# EAGLE board Arch Max (EAGLE 6.4)
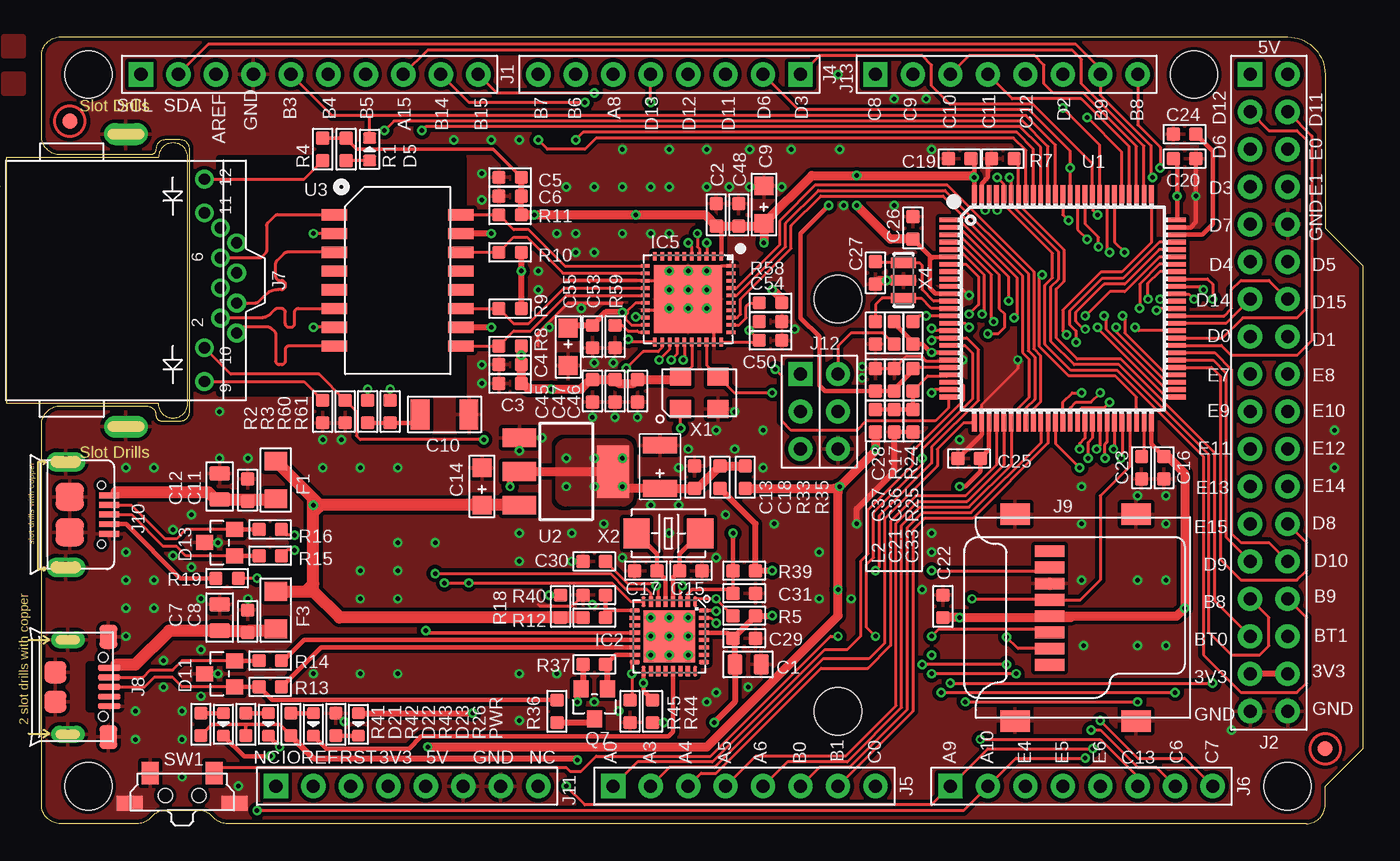
[diagram p2: board, top side]
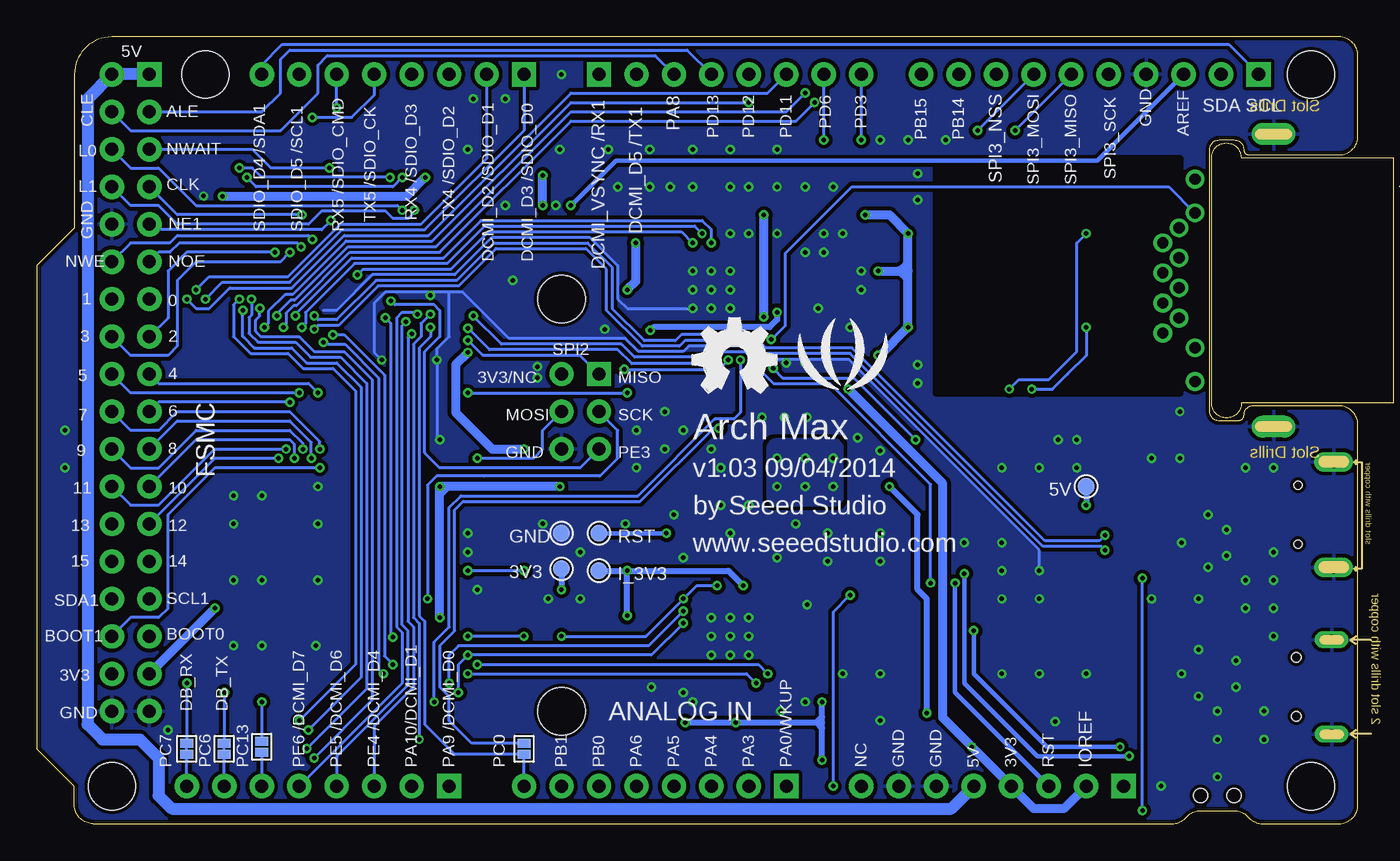
[diagram p3: board, bottom side, seen from below]

Size 89.53 x 53.34 mm. Coordinates in mm from the lower left corner, seen from the top.
Outline: 85.72,0 12.59,0 arc-45 11.69,0.37 11.55,0.52 arc45 10.65,0.89 8.4,0.89 arc45 7.5,0.52 7.36,0.37 arc-45 6.46,0 1.27,0 arc-90 0,1.27 0,27.05 arc-90 1.27,28.32 7.11,28.32 arc-90 7.75,27.69 arc90 8.13,27.3 9.4,27.3 arc90 10.03,27.94 10.03,45.72 arc90 9.4,46.35 8.38,46.35 arc90 7.75,45.72 arc-90 7.37,45.34 1.27,45.34 arc-90 0,46.61 0,52.07 arc-90 1.27,53.34 84.45,53.34 arc-90 86.99,50.8 86.99,40.39 89.53,37.85 89.53,5.08 86.99,2.54 86.99,1.27 arc-90 85.72,0
Copper layers (1*16): Top 0.035mm / dielectric 1.5mm / Bottom 0.035mm
Design rules "SeeedStudio_2layer_DRU_no_angle_20140221 *": minimum track width 6mil, minimum drill 12mil, track to track 6mil, track to pad 6mil, pad to pad 6mil, via to via 6mil, smd to smd 0mil, copper to edge 10mil, drill to drill 10mil, minimum pad ring 10mil, minimum via ring 6mil, stop-mask expansion 2mil, vias tented up to drill 100mil, thermal gap 10mil
Net classes: 0 default: width 0.102 mm, drill 0.203 mm, clearance 0.102 mm
Holes 3.2 mm at 78.11,50.8 84.45,2.54 53.97,35.56 3.17,50.8 3.17,2.54 53.97,7.62
tRestrict: area 12.1,29.2 to 28.6,45.1
bRestrict: area 12.1,29.2 to 28.6,45.1

## Footprints (pad centres in the part's own frame; a part is rotated, then mirrored left to right if it is on the bottom)
TP_4545 = smd 1.143 x 1.143: T 0,0
C0805 = smd 1.016 x 1.397: 1 -0.889,0; 2 0.889,0
C0603 = smd 0.889 x 0.889: 1 -0.762,0; 2 0.762,0
AVX-A = smd 1.27 x 1.27: + -1.27,0; - 1.27,0
C1206 = smd 1.27 x 2.032: 1 -1.651,0; 2 1.651,0
AVX-B = smd 1.143 x 2.286: + -1.46,0; - 1.46,0
LED-0603 = smd 0.762 x 0.889: + -0.762,0; - 0.762,0
SOT23 = smd 1.016 x 1.143: 1 -0.889,-1.016; 2 0.889,-1.016; 3 0,1.016
F1206 = smd 1.27 x 1.524: 1 -1.27,0; 2 1.27,0
MBED-ICS_HVQFN33 = smd 0.7 x 0.28: 1 -2.35,1.75; 2 -2.35,1.25; 3 -2.35,0.75; 4 -2.35,0.25; 5 -2.35,-0.25; 6 -2.35,-0.75; 7 -2.35,-1.25; 8 -2.35,-1.75; 17 2.35,-1.75; 18 2.35,-1.25; 19 2.35,-0.75; 20 2.35,-0.25; 21 2.35,0.25; 22 2.35,0.75; 23 2.35,1.25; 24 2.35,1.75 | smd 0.28 x 0.7: 9 -1.75,-2.35; 10 -1.25,-2.35; 11 -0.75,-2.35; 12 -0.25,-2.35; 13 0.25,-2.35; 14 0.75,-2.35; 15 1.25,-2.35; 16 1.75,-2.35; 25 1.75,2.35; 26 1.25,2.35; 27 0.75,2.35; 28 0.25,2.35; 29 -0.25,2.35; 30 -0.75,2.35; 31 -1.25,2.35; 32 -1.75,2.35 | smd 3.5 x 3.5: EXP 0,0
LLP-40 = smd 0.25 x 0.6: 1 2.25,2.9; 2 1.75,2.9; 3 1.25,2.9; 4 0.75,2.9; 5 0.25,2.9; 6 -0.25,2.9; 7 -0.75,2.9; 8 -1.25,2.9; 9 -1.75,2.9; 10 -2.25,2.9; 21 -2.25,-2.9; 22 -1.75,-2.9; 23 -1.25,-2.9; 24 -0.75,-2.9; 25 -0.25,-2.9; 26 0.25,-2.9; 27 0.75,-2.9; 28 1.25,-2.9; 29 1.75,-2.9; 30 2.25,-2.9 | smd 0.6 x 0.25: 11 -2.9,2.25; 12 -2.9,1.75; 13 -2.9,1.25; 14 -2.9,0.75; 15 -2.9,0.25; 16 -2.9,-0.25; 17 -2.9,-0.75; 18 -2.9,-1.25; 19 -2.9,-1.75; 20 -2.9,-2.25; 31 2.9,-2.25; 32 2.9,-1.75; 33 2.9,-1.25; 34 2.9,-0.75; 35 2.9,-0.25; 36 2.9,0.25; 37 2.9,0.75; 38 2.9,1.25; 39 2.9,1.75; 40 2.9,2.25 | smd 4.6 x 4.6: DAP 0,0
10P-2.54-65/35MIL = drill 0.889 pad 1.651 square: 1 0,11.43 | drill 0.889 pad 1.651: 2 0,8.89; 3 0,6.35; 4 0,3.81; 5 0,1.27; 6 0,-1.27; 7 0,-3.81; 8 0,-6.35; 9 0,-8.89; 10 0,-11.43
2.54-2X18P = drill 0.889 pad 1.651 square: 1 -1.27,21.59 | drill 0.889 pad 1.651: 2 -1.27,19.05; 3 -1.27,16.51; 4 -1.27,13.97; 5 -1.27,11.43; 6 -1.27,8.89; 7 -1.27,6.35; 8 -1.27,3.81; 9 -1.27,1.27; 10 -1.27,-1.27; 11 -1.27,-3.81; 12 -1.27,-6.35; 13 -1.27,-8.89; 14 -1.27,-11.43; 15 -1.27,-13.97; 16 -1.27,-16.51; 17 -1.27,-19.05; 18 -1.27,-21.59; 19 1.27,-21.59; 20 1.27,-19.05; 21 1.27,-16.51; 22 1.27,-13.97; 23 1.27,-11.43; 24 1.27,-8.89; 25 1.27,-6.35; 26 1.27,-3.81; 27 1.27,-1.27; 28 1.27,1.27; 29 1.27,3.81; 30 1.27,6.35; 31 1.27,8.89; 32 1.27,11.43; 33 1.27,13.97; 34 1.27,16.51; 35 1.27,19.05; 36 1.27,21.59
CK_1X8 = drill 0.889 pad 1.651 square: 1 0,8.89 | drill 0.889 pad 1.651: 2 0,6.35; 3 0,3.81; 4 0,1.27; 5 0,-1.27; 6 0,-3.81; 7 0,-6.35; 8 0,-8.89
RJ45-MJ88-BX11-RVSL2 = drill 0.762 pad 1.27: 1 3.57,7.5; 2 2.55,6.4; 3 1.53,7.5; 4 0.51,6.4; 5 -0.51,7.5; 6 -1.53,6.4; 7 -2.55,7.5; 8 -3.57,6.4; 9 6.86,5.32; 10 4.57,5.32; 11 -4.57,5.32; 12 -6.86,5.32 | drill 0.6 pad 1.5 long: 13 -9.92,0; 14 9.92,0
MICRO-USB = smd 0.381 x 1.524: 1 -1.3,-0.25; 2 -0.65,-0.25; 3 0,-0.25; 4 0.65,-0.25; 5 1.3,-0.25 | smd 1.6 x 1.2: S1 -3.4,-0.3; S6 3.4,-0.3 | drill 0.635 pad 1.143 long: S2 -3.2,-3.048; S5 3.2,-3.048 | smd 1.5 x 1.5: S3 -1,-3.9; S4 1,-3.9 | hole 0.635: -2,-0.65; 2,-0.65
8P-SMD = smd 0.8 x 2.008: 1 -3.198,0.254; 2 -2.098,0.254; 3 -0.998,0.254; 4 0.102,0.254; 5 1.202,0.254; 6 2.302,0.254; 7 3.402,0.254; 8 4.502,0.254 | smd 1.45 x 2: 9 -7.002,2.6; 10 7.002,2.6; 11 -7.002,-5.598; 12 7.002,-5.598
MICRO-USB-5P-AB = smd 0.4 x 1.35: 1 -1.3,2.675; 2 -0.65,2.675; 3 0,2.675; 4 0.65,2.675; 5 1.3,2.675 | smd 1.9 x 1.9: P1 -1.2,0; P2 1.2,0 | drill 0.8 pad 1.2 long: P3 -3.575,-0.265; P4 3.575,-0.265 | hole 0.55: -2,2.15; 2,2.15
2X3P-2.54-65/35MIL = drill 0.889 pad 1.651 square: 1 -1.27,2.54 | drill 0.889 pad 1.651: 2 -1.27,0; 3 -1.27,-2.54; 4 1.27,-2.54; 5 1.27,0; 6 1.27,2.54
L0603 = smd 0.889 x 0.889: 1 -0.762,0; 2 0.762,0
2P-SMD-1.78X1.27 = smd 0.889 x 0.61: 1 0,0.381; 2 0,-0.381
ROUND-MARK-1.0 = smd 1.016 x 1.016: P$1 0,0
R0603 = smd 0.889 x 0.889: 1 -0.762,0; 2 0.762,0
4P-SMD-7X3.5X3.5H = smd 1.143 x 1.524: 1 -2.159,1.524; 2 2.159,1.524 | smd 1.778 x 1.016: S1 -3.556,-0.508; S2 3.556,-0.508 | hole 0.95: -1.15,0; 1.15,0
LQFP100 = smd 1.2 x 0.32: 1 -7.75,6; 2 -7.75,5.5; 3 -7.75,5; 4 -7.75,4.5; 5 -7.75,4; 6 -7.75,3.5; 7 -7.75,3; 8 -7.75,2.5; 9 -7.75,2; 10 -7.75,1.5; 11 -7.75,1; 12 -7.75,0.5; 13 -7.75,0; 14 -7.75,-0.5; 15 -7.75,-1; 16 -7.75,-1.5; 17 -7.75,-2; 18 -7.75,-2.5; 19 -7.75,-3; 20 -7.75,-3.5; 21 -7.75,-4; 22 -7.75,-4.5; 23 -7.75,-5; 24 -7.75,-5.5; 25 -7.75,-6; 51 7.75,-6; 52 7.75,-5.5; 53 7.75,-5; 54 7.75,-4.5; 55 7.75,-4; 56 7.75,-3.5; 57 7.75,-3; 58 7.75,-2.5; 59 7.75,-2; 60 7.75,-1.5; 61 7.75,-1; 62 7.75,-0.5; 63 7.75,0; 64 7.75,0.5; 65 7.75,1; 66 7.75,1.5; 67 7.75,2; 68 7.75,2.5; 69 7.75,3; 70 7.75,3.5; 71 7.75,4; 72 7.75,4.5; 73 7.75,5; 74 7.75,5.5; 75 7.75,6 | smd 0.32 x 1.2: 26 -6,-7.75; 27 -5.5,-7.75; 28 -5,-7.75; 29 -4.5,-7.75; 30 -4,-7.75; 31 -3.5,-7.75; 32 -3,-7.75; 33 -2.5,-7.75; 34 -2,-7.75; 35 -1.5,-7.75; 36 -1,-7.75; 37 -0.5,-7.75; 38 0,-7.75; 39 0.5,-7.75; 40 1,-7.75; 41 1.5,-7.75; 42 2,-7.75; 43 2.5,-7.75; 44 3,-7.75; 45 3.5,-7.75; 46 4,-7.75; 47 4.5,-7.75; 48 5,-7.75; 49 5.5,-7.75; 50 6,-7.75; 76 6,7.75; 77 5.5,7.75; 78 5,7.75; 79 4.5,7.75; 80 4,7.75; 81 3.5,7.75; 82 3,7.75; 83 2.5,7.75; 84 2,7.75; 85 1.5,7.75; 86 1,7.75; 87 0.5,7.75; 88 0,7.75; 89 -0.5,7.75; 90 -1,7.75; 91 -1.5,7.75; 92 -2,7.75; 93 -2.5,7.75; 94 -3,7.75; 95 -3.5,7.75; 96 -4,7.75; 97 -4.5,7.75; 98 -5,7.75; 99 -5.5,7.75; 100 -6,7.75
SOT-223 = smd 1.27 x 2.286: 1 -2.286,-3.175; 2 0,-3.175; 3 2.286,-3.175 | smd 3.556 x 2.159: TER 0,3.175
SOIC16-9.53 = smd 0.762 x 1.714: 1 -4.445,-4.286; 2 -3.175,-4.286; 3 -1.905,-4.286; 4 -0.635,-4.286; 5 0.635,-4.286; 6 1.905,-4.286; 7 3.175,-4.286; 8 4.445,-4.286; 9 4.445,4.286; 10 3.175,4.286; 11 1.905,4.286; 12 0.635,4.286; 13 -0.635,4.286; 14 -1.905,4.286; 15 -3.175,4.286; 16 -4.445,4.286
4P-SMD-5X3.2 = smd 1.4 x 1.2: 1 -1.27,-1.1; 2 1.27,-1.1; 3 1.27,1.1; 4 -1.27,1.1
2P-SMD-5X3.2 = smd 1.778 x 2.032: 1 -2.159,0; 2 2.159,0
3P-SMD-3.6X1.3 = smd 0.7 x 1.7: 1 -1.2,0; 2 0,0; 3 1.2,0

## Placement (x,y rotation side)
3V3  [TP_4545]  53.97,17.27 270 bottom
5V  [TP_4545]  18.41,22.86 270 bottom
C1  10uF  [C0805]  47.88,10.79 180 top
C2  100nF  [C0603]  45.72,41.27 270 top
C3  100nF  [C0603]  31.75,29.84 180 top
C4  100nF  [C0603]  31.75,31.11 180 top
C5  100nF  [C0603]  31.75,43.81 180 top
C6  100nF  [C0603]  31.75,42.55 180 top
C7  10uF  [C0805]  12.07,13.97 90 top
C8  100nF  [C0603]  13.97,13.72 90 top
C9  16V 10uF  [AVX-A]  48.96,41.97 90 top
C10  1000v_1nF  [C1206]  27.3,27.75 180 top
C11  100nF  [C0603]  13.97,22.61 90 top
C12  10uF  [C0805]  12.07,22.86 90 top
C13  10V 47uF  [AVX-B]  41.91,24.19 90 top
C14  10uF/16v  [AVX-A]  29.85,22.86 90 top
C15  18pF  [C0603]  44.01,17.14 180 top
C16  100nF  [C0603]  76.07,24.13 90 top
C17  18pF  [C0603]  40.96,17.14 0 top
C18  100nF  [C0603]  44.26,23.5 270 top
C19  100nF  [C0603]  62.23,45.09 0 top
C20  100nF  [C0603]  77.47,45.09 180 top
C21  100nF  [C0603]  57.78,27.3 90 top
C22  100nF  [C0603]  61.09,14.73 90 top
C23  2.2uF  [C0603]  74.55,24.13 90 top
C24  2.2uF  [C0603]  77.47,46.74 0 top
C25  100nF  [C0603]  62.86,24.77 0 top
C26  100nF  [C0603]  59.05,40.39 270 top
C27  12pF  [C0603]  56.52,37.34 90 top
C28  12pF  [C0603]  56.52,33.27 90 top
C29  100nF  [C0603]  47.62,12.57 180 top
C30  100nF  [C0603]  37.46,17.78 0 top
C31  100nF  [C0603]  47.62,15.62 180 top
C33  1uF  [C0603]  59.05,27.3 90 top
C36  1uF  [C0603]  57.78,30.1 270 top
C37  100nF  [C0603]  56.52,30.1 270 top
C45  100nF  [C0603]  37.34,29.34 90 top
C46  100nF  [C0603]  40.39,29.34 90 top
C47  100nF  [C0603]  38.86,29.34 270 top
C48  100nF  [C0603]  47.24,41.27 90 top
C50  100nF  [C0603]  49.4,32.77 0 top
C53  100nF  [C0603]  37.34,33.02 90 top
C54  100nF  [C0603]  49.4,34.04 180 top
C55  16V 10uF  [AVX-A]  35.69,32.32 270 top
D5  GREEN  [LED-0603]  22.23,45.72 90 top
D11  CESD3V3AP  [SOT23]  12.07,10.16 90 top
D13  CESD3V3AP  [SOT23]  12.07,19.05 90 top
D21  RED  [LED-0603]  12.32,6.73 270 top
D22  BULE  [LED-0603]  15.37,6.73 270 top
D23  YELLOW  [LED-0603]  18.41,6.73 270 top
F1  PPTC_750mA  [F1206]  15.88,23.3 90 top
F3  PPTC_750mA  [F1206]  15.88,14.48 90 top
GND  [TP_4545]  53.97,19.68 270 bottom
I_3V3  [TP_4545]  51.43,17.14 270 bottom
IC2  LPC11U35FHI33/501  [MBED-ICS_HVQFN33]  42.54,12.7 270 top
IC5  DP83848J  [LLP-40]  43.81,35.56 0 top
J1  [10P-2.54-65/35MIL]  18.16,50.8 90 top
J2  2.54 Female 2*18p  [2.54-2X18P]  83.19,29.21 0 top
J4  2.54 female 8p  [CK_1X8]  42.54,50.8 270 top
J5  2.54 female 8p  [CK_1X8]  47.62,2.54 90 top
J6  2.54 female 8p  [CK_1X8]  70.48,2.54 90 top
J7  RJ45-MJ88-BX11-RVSL2  [RJ45-MJ88-BX11-RVSL2]  5.71,36.83 270 top
J8  340005001  [MICRO-USB]  4.83,9.27 270 top
J9  [8P-SMD]  68.58,13.97 90 top
J10  [MICRO-USB-5P-AB]  1.9,20.95 270 top
J11  2.54 female 8p  [CK_1X8]  24.77,2.54 90 top
J12  [2X3P-2.54-65/35MIL]  52.7,27.94 0 top
J13  2.54 female 8p  [CK_1X8]  65.41,50.8 90 top
L2  120R-500mA  [L0603]  56.52,27.3 270 top
P1  [2P-SMD-1.78X1.27]  74.3,5.21 180 bottom
P5  [2P-SMD-1.78X1.27]  56.52,5.08 180 bottom
P6  [ROUND-MARK-1.0]  86.99,5.08 0 top
P7  [ROUND-MARK-1.0]  1.9,47.62 0 top
P9  [2P-SMD-1.78X1.27]  76.83,5.08 0 bottom
P10  [2P-SMD-1.78X1.27]  79.38,5.08 180 bottom
PWR  Green  [LED-0603]  21.46,6.73 270 top
Q7  CJ2305  [SOT23]  37.46,8.13 180 top
R1  470R  [R0603]  20.64,45.72 90 top
R2  470R  [R0603]  19.05,27.94 90 top
R3  2.2K  [R0603]  20.57,27.94 90 top
R4  470R  [R0603]  19.05,45.72 270 top
R5  DNP  [R0603]  47.62,14.1 0 top
R7  10K  [R0603]  65.15,45.09 0 top
R8  49.9R_1%  [R0603]  31.75,32.38 180 top
R9  49.9R_1%  [R0603]  31.75,34.92 0 top
R10  49.9R_1%  [R0603]  31.75,38.73 180 top
R11  49.9R_1%  [R0603]  31.75,41.27 0 top
R12  10k  [R0603]  37.46,13.97 180 top
R13  33R  [R0603]  15.49,9.27 180 top
R14  33R  [R0603]  15.49,11.05 180 top
R15  33R  [R0603]  15.49,18.16 180 top
R16  33R  [R0603]  15.49,19.94 180 top
R17  DNP  [R0603]  57.78,33.27 90 top
R18  10k  [R0603]  35.18,14.73 270 top
R19  0R  [R0603]  12.57,16.64 180 top
R24  10K  [R0603]  59.05,33.27 270 top
R25  0R  [R0603]  59.05,30.1 270 top
R26  470R  [R0603]  19.94,6.73 270 top
R33  0R  [R0603]  45.97,23.5 270 top
R35  0R  [R0603]  47.69,23.5 90 top
R36  1.5k  [R0603]  34.92,7.62 90 top
R37  DNP  [R0603]  37.46,10.79 180 top
R39  10k  [R0603]  47.62,17.14 0 top
R40  100k  [R0603]  37.46,15.49 0 top
R41  470R  [R0603]  10.79,6.73 270 top
R42  470R  [R0603]  13.84,6.73 270 top
R43  470R  [R0603]  16.89,6.73 270 top
R44  DNP  [R0603]  41.4,7.62 270 top
R45  DNP  [R0603]  39.88,7.62 90 top
R58  2.2K  [R0603]  49.4,35.31 180 top
R59  4.87K_1%  [R0603]  38.86,33.02 270 top
R60  75R  [R0603]  22.1,27.94 90 top
R61  75R  [R0603]  23.62,27.94 90 top
RST  [TP_4545]  51.43,19.68 0 bottom
SW1  BUTTON-4P-REINFORCE'TS-1188E'  [4P-SMD-7X3.5X3.5H]  9.52,1.91 0 top
U1  [LQFP100]  69.22,34.92 0 top
U2  CJT1117-3.3  [SOT-223]  35.56,23.88 270 top
U3  HX1198NL  [SOIC16-9.53]  24.13,36.83 270 top
U$1  [OSHW_FILLX200_NOTEXT]  45.08,29.21 0 bottom
U$4  [LOGO_SILK]  34.92,31.11 0 bottom
X1  50MHz/052012001  [4P-SMD-5X3.2]  44.58,29.21 0 top
X2  12MHz/050016001  [2P-SMD-5X3.2]  42.48,19.68 0 top
X4  [3P-SMD-3.6X1.3]  58.42,36.83 270 top

## Tracks (layer width: path | path; a pad name or v marks a point on that pad's centre or on a via)
5V
  Bottom 0.813: J2.1 J2.36 86.11,49.15 86.11,6.73 85.09,5.71 82.55,5.71 81.28,4.45 81.28,1.91 80.39,1.02 27.56,1.02 J11.5
50MHZ  (via drill 0.3 pad 0.64)
  Top 0.203: IC5.28 45.06,31.09 X1.3 46.95,29.21 v49.53,29.21 | U1.24 60.54,29.43 v60.32,29.21
  Bottom 0.203: v60.32,29.21 v49.53,29.21
+3.3V  (via drill 0.3 pad 0.64)
  Top 0.203: IC5.18 40.3,34.31 v40.26,34.35 | IC5.26 44.06,32.7 44.07,32.7 44.07,30.99 43.39,30.31 X1.4 | 76.97,45.08 C20.2 | 57.78,33.91 R17.2
  Top 0.254: R4.1 R1.2 20.64,46.42 21.34,45.72 30.61,45.72 C5.1
  Top 0.305: U1.28 64.22,25.35 C25.2 63.63,23.88 62.61,22.86 v62.23,22.86 | U1.100 v63.21,43.81 63.21,44.86 C19.2 | U1.75 v76.97,42.54 76.97,45.08 | R24.2 59.05,32.38 | R17.2 57.78,34.16 | U1.50 75.22,25.75 C16.2 | IC5.1 46.06,40.26 | 46.06,40.26 46.06,40.8 | 57.78,33.91 59.05,32.64 R24.2 | C2.2 45.81,40.51 46.06,40.26 | U1.6 60.4,38.42 | 60.4,38.42 60.25,38.42 | 60.25,38.42 60.2,38.48 | 60.2,38.48 C26.2 | U1.11 60.59,35.92 60.2,36.32 60.2,38.23 | 60.2,38.23 60.2,38.37 | 60.2,38.37 60.25,38.42 | 60.2,38.37 60.2,38.48 | U1.19 60.31,31.93 | R24.2 59.69,32.51 60.28,31.93 60.31,31.93 | 60.4,38.42 60.2,38.23 | 60.31,31.93 v60.32,31.94
  Top 0.406: C5.1 C6.1 R11.2 | R10.1 v32.51,37.47 R9.2 | U3.10 v30.48,33.66 | v30.48,40.01 U3.15 | 37.08,29.84 C45.2 37.21,30.1 | J2.20 J2.17 | C25.2 63.63,24.64 | 43.2,30.2 X1.4
  Top 0.61: R11.2 v33.4,41.27 v40.26,41.27 44.96,41.27 C2.2 C48.1 48.77,40.51 C9.+ | C16.2 76.33,24.89 77.47,23.75 v77.47,14.61 76.94,14.07 69.85,14.07 | J9.4 69.85,14.07 | 69.85,14.07 69.75,13.97 v62.23,13.97 C22.1 | C9.+ v48.96,39.37 | C9.+ 52.2,43.94 v55.24,43.94 63.09,43.94 v63.21,43.81 | v54.1,22.86 53.97,22.86 53.97,22.73 | 53.97,22.48 v53.97,15.88 53.97,14.1 45.08,5.21 v26.16,5.21 | 53.97,22.48 53.97,22.73 | 53.97,22.48 53.72,22.73 | R8.1 v32.51,31.75 C4.1 32.51,29.97 | 32.51,29.97 C3.1 | 32.51,29.97 33.02,29.46 v34.54,29.46 36.58,29.46 37.21,30.1 | C45.2 C47.1 39.12,29.84 40.13,29.84 C46.2 43.1,30.1 43.2,30.2 | L2.2 v56.52,25.4 56.52,25.27 v54.1,22.86 | R35.1 53.97,22.73 | 53.97,22.73 v54.1,22.86 | R58.1 50.16,35.56 v49.53,36.2 | C26.2 57.53,39.62 v55.24,41.91
  Bottom 0.406: 3V3.T v53.97,15.88
  Bottom 0.61: 30.48,37.47 v30.48,33.66 32.38,31.75 v32.51,31.75 | 30.48,37.47 v30.48,40.01 31.75,41.27 v33.4,41.27 | v32.51,37.47 31.12,37.47 | 31.12,37.47 30.48,37.47 | J2.17 v77.47,14.61 | 31.12,37.47 arc-45 30.9,37.55 30.61,37.85 | 31.12,37.47 arc45 30.9,37.38 30.61,37.08 | v76.97,42.54 64.49,42.54 v63.21,43.81 | v34.54,29.46 28.13,23.05 28.13,7.18 v26.16,5.21 J11.4 21.97,1.02 19.94,1.02 J11.2 | v40.26,34.35 v40.26,41.27 | v48.96,39.37 48.96,36.77 v49.53,36.2 | v55.24,41.91 v55.24,43.94 | v60.32,31.94 61.15,31.11 61.15,27.88 58.67,25.4 v56.52,25.4 | v54.1,22.86 61.72,22.86 | 61.72,22.86 62.1,22.86 | v62.23,13.97 62.23,22.35 | 62.23,22.35 v62.23,22.86 | 61.72,22.86 62.23,22.35
  pour Top: -2.54,50.8 -1.27,50.8 -1.27,49.53 -2.54,49.53
AREF  (via drill 0.3 pad 0.64)
  Top 0.203: U1.21 59.37,30.93 59.31,30.86 R25.1
  Top 0.305: R25.1 59.05,30.73 57.78,29.46 C36.2 C37.2 53.09,29.34 52.7,29.72 52.7,33.02 51.43,34.29 51.43,40.01 v53.34,41.91
  Bottom 0.305: v53.34,41.91 50.29,44.96 17.65,44.96 J1.3
BOOT0
  Top 0.203: J2.16 79.5,15.11 79.5,25.15 73.15,31.5 70.2,31.5 68.76,32.93 68.76,36.25 69.28,36.77 69.28,38.92 66.22,41.99 U1.94 66.22,45.04 66.17,45.09 R7.2
BOOT1  (via drill 0.3 pad 0.64)
  Top 0.203: U1.37 68.72,25.77 v70.36,24.13
  Bottom 0.203: v70.36,24.13 77.47,24.13 80.64,20.95 80.64,14.61 81.28,13.97 83.19,13.97 J2.21
DB_RX  (via drill 0.3 pad 0.64)
  Top 0.203: v61.59,9.53 v79.38,9.53
  Top 0.254: IC2.32 45.68,14.45 v45.72,14.41
  Bottom 0.203: v45.72,14.41 48.07,12.06 60.96,12.06 61.59,11.43 v61.59,9.53 | v79.38,9.53 P10.2
DB_TX  (via drill 0.3 pad 0.64)
  Top 0.203: IC2.31 45.36,13.95 v45.72,13.59 | v60.96,8.89 v76.83,8.89
  Bottom 0.203: v45.72,13.59 47.88,11.43 v60.32,11.43 60.96,10.79 v60.96,8.89 | v76.83,8.89 P9.1
ETH_CRS_DV
  Top 0.203: U1.32 66.22,28.18 66.93,28.89 66.93,31.5 66.48,31.94 66.48,37.15 61.09,42.55 52.81,42.55 50.8,40.54 50.8,38.99 47.37,35.56 47.37,34.54 47.14,34.31 IC5.33
ETH_MDC  (via drill 0.3 pad 0.64)
  Top 0.203: U1.16 60.49,33.42 v60.32,33.59 | IC5.25 43.56,31.5 v43.5,31.43
  Bottom 0.203: v43.5,31.43 43.75,31.18 49.21,31.18 50.16,32.13 58.86,32.13 v60.32,33.59
ETH_MDIO  (via drill 0.3 pad 0.64)
  Top 0.203: IC5.24 43.06,31.83 v42.67,31.43 | U1.25 61.46,28.19 60.58,27.3 55.88,27.3 55.24,26.67 50.8,26.67 50.16,27.3 50.16,30.35 v49.72,30.8
  Bottom 0.203: v42.67,31.43 43.31,30.8 v49.72,30.8
ETH_RX_D0
  Top 0.203: IC5.36 47.11,35.81 50.42,39.12 50.42,40.7 52.64,42.93 61.23,42.93 66.87,37.3 66.87,32.07 67.31,31.62 67.31,28.77 66.72,28.17 U1.33
ETH_RX_D1
  Top 0.203: U1.34 67.22,28.1 67.69,28.57 67.69,31.75 67.25,32.19 67.25,37.43 61.37,43.31 52.46,43.31 50.04,40.88 50.04,39.24 47.1,36.31 IC5.37
ETH_TX_D0  (via drill 0.3 pad 0.64)
  Top 0.203: U1.51 76.23,28.93 71.56,33.59 v71.56,33.66 | v44.45,40.01 44.45,39.12 44.58,38.99 44.58,38.47 IC5.4
  Bottom 0.203: v71.56,33.66 71.33,33.88 71.33,34.65 68.02,37.97 61.72,37.97 59.18,40.51 44.96,40.51 v44.45,40.01
ETH_TX_D1  (via drill 0.3 pad 0.64)
  Top 0.203: U1.52 76.24,29.43 72.14,33.53 72.14,34.29 v72.01,34.42 | IC5.5 44.07,39.12 v43.81,39.37
  Bottom 0.203: v43.81,39.37 43.81,40.26 44.45,40.89 59.44,40.89 61.98,38.35 68.2,38.35 72.01,34.54 v72.01,34.42
ETH_TX_EN  (via drill 0.3 pad 0.64)
  Top 0.203: U1.48 74.22,28.91 72.77,30.35 69.62,30.35 67.63,32.35 67.63,37.02 v67.82,37.21 | v45.08,39.37 45.08,38.48 IC5.3
  Bottom 0.203: v67.82,37.21 67.44,37.59 61.47,37.59 58.93,40.13 45.85,40.13 v45.08,39.37
FSMC_D0
  Top 0.203: U1.61 80.28,33.92 J2.7
FSMC_D1
  Top 0.203: U1.62 80.14,34.42 80.64,34.92 80.64,36.2 81.28,36.83 83.19,36.83 J2.30
FSMC_D2  (via drill 0.3 pad 0.64)
  Top 0.203: U1.81 72.72,39.43 v73.41,38.73
  Bottom 0.203: J2.8 80.64,34.29 80.64,37.47 79.38,38.73 v73.41,38.73
FSMC_D3  (via drill 0.3 pad 0.64)
  Top 0.203: U1.82 72.22,38.91 v72.39,38.73
  Bottom 0.203: J2.29 83.19,31.75 80.64,31.75 80.01,32.38 80.01,36.83 78.74,38.1 73.02,38.1 v72.39,38.73
FSMC_D4  (via drill 0.3 pad 0.64)
  Top 0.203: U1.38 69.22,28.57 69.85,29.21 v70.48,29.21
  Bottom 0.203: J2.9 81.28,29.84 71.12,29.84 v70.48,29.21
FSMC_D5  (via drill 0.3 pad 0.64)
  Top 0.203: U1.39 69.72,28.19 70.1,28.57 71.12,28.57 v71.75,29.21
  Bottom 0.203: v71.75,29.21 83.19,29.21 J2.28
FSMC_D6  (via drill 0.3 pad 0.64)
  Top 0.203: U1.40 70.22,27.92 70.48,28.19 72.01,28.19 v72.39,28.57
  Bottom 0.203: v72.39,28.57 81.28,28.57 J2.10
FSMC_D7  (via drill 0.3 pad 0.64)
  Top 0.203: v70.36,25.4 70.36,25.78 70.72,26.14 U1.41
  Bottom 0.203: J2.27 83.19,26.67 81.28,26.67 80.01,27.94 72.39,27.94 70.36,25.91 v70.36,25.4
FSMC_D8  (via drill 0.3 pad 0.64)
  Top 0.203: v70.93,24.77 70.93,25.84 71.22,26.13 U1.42
  Bottom 0.203: v70.93,24.77 70.93,25.84 72.39,27.3 80.01,27.3 J2.11
FSMC_D9  (via drill 0.3 pad 0.64)
  Top 0.203: U1.43 71.72,25.61 v71.5,25.4
  Bottom 0.203: J2.26 83.19,24.13 81.28,24.13 78.74,26.67 72.39,26.67 71.5,25.78 v71.5,25.4
FSMC_D10  (via drill 0.3 pad 0.64)
  Top 0.203: v72.07,24.77 72.07,25.72 72.22,25.86 U1.44
  Bottom 0.203: v72.07,24.77 72.07,25.72 72.39,26.04 78.74,26.04 J2.12
FSMC_D11  (via drill 0.3 pad 0.64)
  Top 0.203: U1.45 72.72,25.47 v72.64,25.4
  Bottom 0.203: J2.25 83.19,21.59 81.28,21.59 77.47,25.4 v72.64,25.4
FSMC_D12  (via drill 0.3 pad 0.64)
  Top 0.203: v73.15,24.77 73.28,24.89 73.28,27.11 U1.46
  Bottom 0.203: v73.15,24.77 77.47,24.77 J2.13
FSMC_D13
  Top 0.203: U1.55 79.31,30.93 79.88,30.35 79.88,17.91 81.28,16.51 85.09,16.51 85.72,17.14 85.72,19.05 J2.24
FSMC_D14
  Top 0.203: U1.56 79.41,31.43 80.26,30.57 80.26,19.43 J2.14
FSMC_D15
  Top 0.203: U1.57 79.51,31.93 80.64,30.79 80.64,19.68 81.28,19.05 83.19,19.05 J2.23
FSMC_NBL0  (via drill 0.3 pad 0.64)
  Top 0.203: U1.97 64.72,41.65 v64.77,41.59
  Bottom 0.203: J2.34 83.19,44.45 81.28,44.45 78.74,41.91 65.09,41.91 v64.77,41.59
FSMC_NBL1  (via drill 0.3 pad 0.64)
  Top 0.203: U1.98 64.22,41.86 v63.95,41.59
  Bottom 0.203: J2.33 83.19,41.91 81.28,41.91 80.01,40.64 71.12,40.64 70.23,41.53 65.91,41.53 65.41,41.02 64.39,41.02 63.95,41.47 v63.95,41.59
FSMC_NE1/NCE2  (via drill 0.3 pad 0.64)
  Top 0.203: U1.88 | U1.88 69.22,42.74 69.15,42.8 | U1.88 69.22,41.27 v69.6,40.89
  Bottom 0.203: J2.5 81.53,40.26 70.23,40.26 v69.6,40.89
FSMC_NOE  (via drill 0.3 pad 0.64)
  Top 0.203: U1.85 70.72,40.66 71.63,39.75 v71.63,39.12
  Bottom 0.203: J2.6 81.28,38.73 80.52,38.73 79.88,39.37 71.88,39.37 v71.63,39.12
FSMC_NWE  (via drill 0.3 pad 0.64)
  Top 0.203: 70.23,42.67 U1.86 70.22,40.27 v70.87,39.62
  Bottom 0.203: J2.31 83.19,39.37 80.52,39.37 80.01,39.88 71.12,39.88 v70.87,39.62
GND  (via drill 0.3 pad 0.64)
  Top 0.203: 35.56,36.83 35.58,36.81 IC5.13 42.52,36.81 42.52,37.45 v42.54,37.47 | 39.37,35.31 35.69,35.31 33.66,33.27 33.66,32.38 | C37.1 C36.1 58.61,31.69 59.63,31.69 59.94,31.37 61.41,31.37 U1.20 62.41,31.43 v62.42,31.43 | IC5.17 42.02,34.81 | IC5.29 45.56,33.81 | IC5.40 46.06,37.81 45.72,37.47 v45.08,37.47 | 42.02,35.04 42.02,35.67 v42.54,36.2 | U1.10 62.25,36.42 v62.86,35.81 | v66.17,31.43 66.17,30.86 63.71,28.41 U1.27 | R40.1 35.94,14.73 33.78,14.73 33.66,14.86 | v37.34,14.86 36.96,15.24
  Top 0.254: R26.1 v20.51,6.92 20.7,6.73 | C21.1 57.78,26.67
  Top 0.305: U1.99 63.71,43.4 64.14,43.81 64.14,44.83 R7.1 | C20.1 78.23,40.77 77.89,40.42 U1.74 | U1.27 63.71,26.38 C25.1 | C21.1 C33.1
  Top 0.406: 42.02,34.81 42.02,35.04 | v55.24,20.32 55.24,21.34 57.78,23.88 C21.1
  Top 0.61: X4.2 56.77,36.83 C27.1
  Bottom 0.203: 70.1,34.8 69.22,34.8 66.8,37.21 61.21,37.21 58.67,39.75 52.07,39.75 50.16,37.85 50.16,35.57 49.52,34.92 v45.08,34.92 | v21.59,17.14 21.59,18.54 34.54,31.5 40.51,31.5 41.4,32.38 45.34,32.38 45.71,32.01 48.77,32.01 49.66,32.89 57.53,32.89 60.71,36.07 61.59,36.07 | 61.59,36.07 65.91,36.07 66.67,35.31 66.67,31.94 v66.17,31.43 | v62.23,26.04 62.42,26.23 v62.42,31.43 62.42,32.19 61.59,33.02 61.59,36.07
  other vias: 11.94,19.05 6.35,7.62 11.94,10.16 6.35,5.71 39.12,7.62 37.46,8.26 41.27,13.97 42.54,13.97 43.81,13.97 43.81,12.7 43.81,11.43 42.54,11.43 41.27,11.43 41.27,12.7 42.54,12.7 47.88,9.27 45.72,18.03 80.64,6.35 70.61,12.06 74.3,12.06 70.48,16.51 76.2,22.23 74.3,22.23 59.69,15.88 43.81,37.47 45.08,36.2 43.81,36.2 33.66,37.47 34.92,40.01 36.2,38.73 29.85,42.29 29.85,44.07 39.37,40.01 36.2,40.01 48.89,26.67 18.41,10.16 21.59,10.16 24.13,10.16 45.72,8.89 45.08,8.26 60.32,45.72 53.97,50.8 78.23,42.55 59.94,49.15 57.78,49.15 33.66,36.2 36.58,34.92 13.97,15.24 12.07,24.77 13.97,24.77 19.05,26.04 20.32,26.04 45.08,43.18 50.16,43.18 48.01,43.18 46.61,43.18 42.54,40.01 37.34,27.56 38.86,27.56 40.39,27.56 37.46,38.73 34.42,33.66 45.72,26.67 32.38,25.27 32.38,17.78 43.18,24.13 55.63,30.23 42.54,43.18 39.37,43.18 39.37,18.03 32.38,10.16 24.13,17.14 87.63,26.67 87.63,24.13 37.46,43.18 35.56,43.18 41.27,43.18 32.38,6.99 60.32,19.68 60.32,18.41 32.38,19.68 26.67,19.05 24.13,15.24 21.59,15.24 24.13,19.05 34.92,10.16 35.94,17.78 5.71,18.41 10.16,17.4 7.62,24.13 5.71,24.13 12.07,27.94 19.05,24.13 33.91,26.16 29.85,31.11 29.85,29.84 37.46,31.24 38.73,31.24 32.38,46.35 39.37,45.72 42.54,45.72 45.08,45.72 48.01,45.72 50.8,45.72 54.1,45.72 27.94,46.35 30.48,46.35 48.89,24.13 46.99,25.4 52.7,18.41 49.66,20.32 46.35,20.95 35.94,19.68 41.27,40.01 42.54,34.92 43.81,34.92 70.48,22.86 70.48,20.32 76.2,20.32 74.3,16.51 76.2,16.51 76.2,12.06 57.28,36.83 55.63,30.99 51.05,33.53 57.78,41.91 54.36,41.91 24.13,24.13 21.59,24.13 41.27,21.59 43.18,21.59 42.54,19.68 38.1,20.32 52.7,15.24 54.86,15.24 43.81,25.4 46.99,27.94 9.52,3.17 13.34,2.54 10.79,8.64 9.52,5.71 7.62,16.51 5.71,16.51 5.71,12.7 5.71,14.61 7.62,14.61 8.25,11.05 10.79,15.24 8.89,19.94 10.16,20.95 8.89,18.16 8.25,9.27 10.79,11.81 9.52,7.62
  pour Top: -2.54,53.34 -1.27,53.34 -1.27,52.07 -2.54,52.07
  pour Bottom (isolate 0.254, rank 6): 0,53.34 89.53,53.34 89.53,0 0,0
  pour Top (isolate 0.254, rank 6): 0,53.34 89.53,53.34 89.53,0 0,0
GREEN  (via drill 0.3 pad 0.64)
  Top 0.254: IC2.12 26.17,12.95 v26.04,13.08
  Top 0.305: v16.13,5.21 D22.-
  Bottom 0.305: v26.04,13.08 26.04,10.16 21.08,5.21 v16.13,5.21
GREEN1  (via drill 0.3 pad 0.64)
  Top 0.203: IC2.7 41.29,15.6 41.02,15.88 39.62,15.88 38.54,16.95 v26.67,16.95
  Top 0.305: v15.49,4.57 13.72,4.57 D21.-
  Bottom 0.305: v26.67,16.95 26.67,9.53 21.72,4.57 v15.49,4.57
I2C1_SCL  (via drill 0.3 pad 0.64)
  Top 0.203: v65.59,43.81 65.72,43.7 U1.95 65.72,41.98 68.9,38.8 68.9,36.89 68.4,36.4 68.4,32.7 69.98,31.11 73.02,31.11 79.12,25.02 79.12,12.95 80.64,11.43 82.55,11.43 83.19,12.06 83.19,13.97 J2.15 | J13.8 74.3,47.37 75.82,45.85 v75.82,44.45
  Bottom 0.203: v65.59,43.81 74.3,43.81 74.93,44.45 v75.82,44.45 | J13.8 74.3,51.44 72.9,52.83 8.76,52.83 J1.1
I2C1_SDA  (via drill 0.3 pad 0.64)
  Top 0.203: v64.77,43.81 65.22,43.37 U1.96 65.22,41.97 68.52,38.67 68.52,37.02 68.01,36.51 68.01,32.49 69.77,30.73 72.9,30.73 78.74,24.89 78.74,11.45 81.3,8.89 85.09,8.89 85.72,9.53 85.72,13.97 J2.22 | v75.31,43.81 75.18,43.94 75.18,45.97 71.75,49.4 J13.7 71.75,51.18 70.1,52.83 11.3,52.83 J1.2
  Bottom 0.203: v64.77,43.81 65.41,43.18 74.68,43.18 v75.31,43.81
ID
  Top 0.305: R19.2 9.4,16.64 5.73,20.3 J10.4
LED_LINK  (via drill 0.3 pad 0.64)
  Top 0.203: v29.97,26.04 21.59,26.04 21.34,26.29 21.34,27.94 R3.2 18.8,30.48 12.82,30.48 J7.10 | IC5.22 42.06,32.29 41.78,32 40.77,32 v39.62,30.86
  Bottom 0.203: v29.97,26.04 34.16,30.23 38.99,30.23 v39.62,30.86
LED_SPEED  (via drill 0.3 pad 0.64)
  Top 0.203: IC5.21 39.92,32.66 v39.75,32.83
  Bottom 0.203: v39.75,32.83 38.8,33.78 38.8,38.67 34.29,43.18 12.82,43.18 J7.11
N$1
  Top 0.305: J10.1 5.05,22.25 5.08,22.23 5.08,22.48
  Top 0.813: 14.1,21.97 C12.1 11.81,21.97 11.3,22.48 5.08,22.48 | 14.1,21.97 15.81,21.97 F1.1 | C11.1 14.1,21.97
N$2
  Top 0.203: R17.1 57.02,33.27 54.86,33.27 53.97,32.38 J12.6
N$3  (via drill 0.3 pad 0.64)
  Top 0.203: R5.1 v45.72,15.24 v45.71,15.24 44.48,15.24 IC2.1 | v53.97,12.7 53.47,12.7 45.34,4.57 37.59,4.57 36.58,3.56 35.81,3.56 35.56,3.81 12.07,3.81 SW1.2 | IC2.3 43.29,15.99 v43.43,16.13
  Bottom 0.203: v53.97,12.7 48.25,12.7 v45.71,15.24 44.82,16.13 v43.43,16.13
N$4  (via drill 0.3 pad 0.64)
  Top 0.203: IC5.23 42.56,32.15 v41.85,31.43 | v62.61,8.26 v74.3,8.26
  Bottom 0.203: v41.85,31.43 41.85,27.88 42.29,27.43 43.6,27.43 48.81,22.23 60.79,22.23 61.59,21.42 61.59,13.34 62.61,12.32 v62.61,8.26 | v74.3,8.26 P1.2
N$5
  Top 0.254: IC2.9 38.25,14.45 38.23,14.48
  Top 0.305: R40.2 38.23,14.48 R12.1
N$6
  Top 0.203: J7.9 17.78,29.97 R2.2
N$7
  Top 0.203: J7.12 17.78,43.69 R4.2
N$8
  Top 0.203: D5.+ R1.1
N$9  (via drill 0.3 pad 0.64)
  Top 0.203: v43.31,26.8 X1.1
  Bottom 0.203: v43.31,26.8 43.69,26.8 48.64,21.84 60.65,21.84 61.21,21.28 61.21,13.08 62.23,12.06 62.23,9.27 61.59,8.64 61.59,6.99 60.07,5.46 P5.2
N$10
  Top 0.203: J8.1 4.86,10.57 5.08,10.79
  Top 0.305: 5.11,10.82 5.08,10.79
  Top 0.813: 14.1,13.08 C7.1 8.64,13.08 6.35,10.79 5.08,10.79 | F3.1 15.75,13.08 14.1,13.08 | 14.1,13.08 C8.1
N$12
  Top 0.305: IC2.14 18.93,11.95 R13.1
N$13
  Top 0.305: IC2.13 17.78,12.45 16.38,11.05 R14.1
N$15
  Top 0.203: D13.1 9.78,18.16 9.14,18.8 8.25,18.8 6.1,20.95 J10.3
  Top 0.305: R15.2 D13.1
N$18
  Top 0.305: PWR.- R26.2
N$22
  Top 0.203: D13.2 9.78,19.94 9.14,19.3 8.38,19.3 6.08,21.61 J10.2
  Top 0.305: R16.2 D13.2
N$23  (via drill 0.3 pad 0.64)
  Top 0.406: PWR.+ v29.21,7.49 | U2.2 31.88,23.88 31.75,23.75 v31.75,22.86 | C18.2 44.32,22.73
  Top 0.61: U2.2 U2.TER 38.73,22.99 38.99,22.73 C13.+ | C13.+ 42.54,22.73 42.67,22.61 42.04,22.61 C13.+ | C13.+ C18.2 44.45,22.73 R33.1 R35.2
  Bottom 0.406: v31.75,22.86 29.85,20.95 29.85,15.88 29.21,15.24 v29.21,7.49
  other vias: 35.56,24.77 39.37,24.77 39.37,22.86 37.46,22.86 37.46,24.77 35.56,22.86
  pour Top (isolate 0.254, no thermals): 39.37,21.59 35.56,21.59 arc-90 34.92,22.23 34.92,25.4 arc-90 35.56,26.04 39.37,26.04 arc-90 40,25.4 40,22.23 arc-90
  pour Bottom (isolate 0.254, no thermals): 39.37,21.59 35.56,21.59 arc-90 34.92,22.23 34.92,25.4 arc-90 35.56,26.04 39.37,26.04 arc-90 40,25.4 40,22.23 arc-90
N$24  (via drill 0.3 pad 0.64)
  Top 0.254: IC2.2 43.79,15.6 44.07,15.88 46.61,15.88 C31.2 R39.1
  Top 0.305: v46.86,19.68 R39.1
  Bottom 0.305: RST.T v46.86,19.68
N$25
  Top 0.305: IC2.15 38.88,11.45 R37.1
  Top 0.406: Q7.1 38.35,10.67 R37.1
N$26
  Top 0.305: R42.1 D22.+
N$27
  Top 0.406: R36.1 37.21,6.86 Q7.3
N$28
  Top 0.305: D21.+ R41.1
N$32
  Top 0.305: D23.- 19.3,5.08 24.89,5.08 25.74,5.92 42.5,5.92 42.79,6.22 IC2.21
N$33
  Top 0.305: R43.1 D23.+
N$34
  Top 0.305: IC2.4 42.79,16.7 C15.2 43.24,18.29 X2.2
N$37
  Top 0.305: IC2.5 42.29,16.57 C17.2 41.72,18.29 X2.1
N$56  (via drill 0.3 pad 0.64)
  Top 0.203: U3.2 v18.41,40.01 | v23.62,29.46 R61.2
  Bottom 0.203: v23.62,29.46 22.99,30.1 20.96,30.1 19.05,32 19.05,39.37 v18.41,40.01
N$58  (via drill 0.3 pad 0.64)
  Top 0.203: R60.2 v22.1,29.46 | U3.7 v18.41,33.66
  Bottom 0.203: v22.1,29.46 20.7,29.46 19.75,30.42 19.69,30.48 18.41,31.75 v18.41,33.66
N$59
  Top 0.305: R60.1 R61.1 25.08,27.18 C10.2
N$123
  Top 0.203: R59.1 39.37,33.78 39.75,33.4 40.39,33.4 40.48,33.31 IC5.20
N$127
  Top 0.203: IC5.32 47.27,33.81 47.75,34.29 47.75,35.05 48.01,35.31 R58.2
OTG_FS_DM  (via drill 0.3 pad 0.64)
  Top 0.203: U1.70 75.76,38.42 73.41,36.07 72.39,36.07 v70.74,34.42 | v17.14,19.56 16.64,19.56 R16.1
  Bottom 0.203: v17.14,19.56 17.53,19.18 21.21,19.18 34.29,32.26 40.13,32.26 41.02,33.15 45.85,33.15 46.25,32.74 48.36,32.74 50.55,34.92 50.55,37.72 52.2,39.37 58.55,39.37 61.09,36.83 66.55,36.83 69.22,34.16 70.48,34.16 v70.74,34.42
OTG_FS_DP  (via drill 0.3 pad 0.64)
  Top 0.203: U1.71 75.75,38.92 73.41,36.58 72.01,36.58 70.1,34.67 70.1,34.04 70.61,33.53 v70.74,33.53 | v17.14,18.54 16.64,18.54 R15.1
  Bottom 0.203: v17.14,18.54 17.4,18.8 21.34,18.8 34.42,31.88 40.26,31.88 41.15,32.77 45.59,32.77 45.99,32.37 48.5,32.37 50.93,34.8 50.93,37.59 52.32,38.99 58.42,38.99 60.96,36.45 66.42,36.45 69.09,33.78 70.48,33.78 v70.74,33.53
PA0/WKUP
  Top 0.203: U1.23 62.28,29.93 62.48,29.72 62.48,28.7 59.05,25.27 59.05,24.32 56.01,21.27 56.01,18.29 55.5,17.78 55.5,12.7 54.61,11.81 53.09,11.81 45.47,4.19 40.39,4.19 J5.1
PA3
  Top 0.203: J5.2 42.54,3.81 45.59,3.81 52.96,11.18 56.06,11.18 57.15,12.27 57.15,20.7 60.71,24.26 60.71,25.4 62.48,27.18 U1.26
PA4
  Top 0.203: U1.29 64.72,24.33 62.61,22.23 59.26,22.23 57.53,20.5 57.53,12.08 56,10.54 52.83,10.54 45.72,3.43 44.7,3.43 J5.3
PA5
  Top 0.203: U1.30 65.22,24.32 62.74,21.84 59.39,21.84 57.91,20.36 57.91,8 54.48,4.57 48.39,4.57 J5.4
PA6
  Top 0.203: U1.31 65.72,24.31 62.86,21.46 59.55,21.46 58.29,20.21 58.29,7.87 54.61,4.19 50.55,4.19 J5.5
PA8  (via drill 0.3 pad 0.64)
  Top 0.203: U1.67 79.03,36.92 79.38,36.58 v79.38,35.56
  Bottom 0.203: v79.38,35.56 78.74,34.92 77.85,34.92 76.45,36.32 72.26,36.32 68.71,39.88 62.99,39.88 53.34,49.53 40,49.53 J4.6
PA9  (via drill 0.3 pad 0.64)
  Top 0.203: U1.68 75.78,37.42 74.99,36.64 v74.99,35.56 | v71.25,5.08 64.14,5.08 J6.1 60.32,1.27 36.83,1.27 v35.56,2.54 | v34.42,15.49 R18.1
  Bottom 0.203: v74.99,35.56 74.99,34.48 75.16,34.32 75.16,33.23 75.14,33.23 74.55,32.64 72.01,32.64 70.99,31.62 68.96,31.62 67.18,29.84 67.18,9.14 v71.25,5.08 | v35.56,2.54 35.56,14.35 v34.42,15.49
PA10  (via drill 0.3 pad 0.64)
  Top 0.203: U1.69 75.77,37.92 74.42,36.58 v74.42,34.92 | v70.74,4.45 66.04,4.45 J6.2 62.48,0.89 v14.61,0.89 | v14.61,16.64 R19.1
  Bottom 0.203: v74.42,34.92 74.42,34.42 74.7,34.14 74.7,33.36 74.36,33.02 71.75,33.02 70.74,32 68.71,32 66.8,30.1 66.8,8.38 v70.74,4.45 | v14.61,0.89 v14.61,16.64
PB0
  Top 0.203: U1.35 67.72,25.8 62.99,21.08 59.69,21.08 58.67,20.07 58.67,7.75 54.74,3.81 52.7,3.81 J5.6
PB1
  Top 0.203: U1.36 68.22,25.8 63.12,20.7 59.85,20.7 59.05,19.91 59.05,7.62 J5.7
PB14  (via drill 0.3 pad 0.64)
  Top 0.203: U1.53 76.25,29.93 72.83,33.34 v72.83,33.66 | v36.83,48.9 28.96,48.9 J1.9
  Bottom 0.203: v36.83,48.9 38.1,47.62 53.34,47.62 62.23,38.73 68.33,38.73 71.94,35.12 72.13,35.12 72.64,34.6 72.64,33.85 v72.83,33.66
PB15  (via drill 0.3 pad 0.64)
  Top 0.203: U1.54 76.25,30.43 73.41,33.27 73.41,34.29 v73.28,34.42 | v37.46,49.53 30.86,49.53 J1.10
  Bottom 0.203: v37.46,49.53 38.73,48.26 53.34,48.26 62.48,39.12 68.45,39.12 72.07,35.5 72.33,35.5 73.28,34.54 v73.28,34.42
PC0  (via drill 0.3 pad 0.64)
  Top 0.203: U1.15 62.59,33.92 v62.86,33.66
  Bottom 0.203: v62.86,33.66 62.86,33.02 63.63,32.26 63.63,14.1 63.25,13.72 63.25,6.73 61.21,4.7 P5.1 J5.8
PC13  (via drill 0.3 pad 0.64)
  Top 0.203: U1.7 62.66,37.92 63.5,37.08 63.5,35.18 v62.86,34.54 | v63.63,5.71 71.75,5.71 74.3,3.17 J6.6
  Bottom 0.203: P1.1 J6.6 | v62.86,34.54 63.5,33.91 63.5,33.02 64.01,32.51 64.01,13.97 63.63,13.59 v63.63,5.71
PD3  (via drill 0.3 pad 0.64)
  Top 0.203: J4.1 52.7,52.07 59.69,52.07 60.32,51.44 60.32,50.01 61.57,48.77 67.18,48.77 71.22,44.74 U1.84 71.22,42.7 71.25,42.74 71.25,41.59 v71.56,41.27 71.47,41.37
  Bottom 0.203: J2.4 80.01,41.27 v71.56,41.27
PD6  (via drill 0.3 pad 0.64)
  Top 0.203: U1.87 v69.72,44.45 69.72,45.6 66.92,48.39 51.31,48.39 J4.2
  Bottom 0.203: v69.72,44.45 73.66,44.45 74.93,45.72 J2.3
PD11
  Top 0.203: J2.35 86.11,46.61 86.11,32.77 85.09,31.75 80.64,31.75 79.97,32.42 U1.58
  Bottom 0.203: J4.3 47.62,52.07 69.85,52.07 70.48,51.44 70.48,49.53 73.02,46.99 83.19,46.99 J2.35
PD12
  Top 0.203: J2.2 83.19,46.99 85.09,46.99 85.72,46.35 85.72,34.92 85.09,34.29 81.41,34.29 80.04,32.92 U1.59
  Bottom 0.203: J2.2 74.3,48.26 73.02,49.53 73.02,51.82 72.39,52.45 45.47,52.45 J4.4
PD13  (via drill 0.3 pad 0.64)
  Top 0.203: v41.27,48.9 J4.5 | U1.60 74.33,33.42 v74.11,33.66
  Bottom 0.203: v41.27,48.9 53.34,48.9 62.74,39.5 68.58,39.5 72.2,35.88 72.71,35.88 73.85,34.73 73.85,33.91 v74.11,33.66 74.04,33.72
PE2  (via drill 0.3 pad 0.64)
  Top 0.203: U1.1 62.2,40.92 66.1,37.02 66.1,34.48 v65.91,34.29 | 68.77,12.06 | 68.77,12.06 68.83,12.13 | v65.41,12.64 66.17,11.87 J9.2 68.58,11.87 68.77,12.06
  Bottom 0.203: v65.41,12.64 65.41,12.83 65.53,12.95 65.53,33.91 v65.91,34.29
PE3  (via drill 0.3 pad 0.64)
  Top 0.203: U1.2 62.19,40.42 65.53,37.08 v65.53,35.43
  Bottom 0.203: J12.3 52.7,24.13 62.23,24.13 63.25,25.15 63.25,32 62.23,33.02 62.23,34.8 62.61,35.18 65.28,35.18 v65.53,35.43
PE4  (via drill 0.3 pad 0.64)
  Top 0.203: U1.3 62.18,39.92 64.9,37.21 64.9,34.92 65.28,34.54 65.28,33.66 64.83,33.21 v64.14,33.21
  Bottom 0.203: J6.3 66.67,6.6 64.01,9.27 64.01,13.34 64.39,13.72 64.39,32.96 v64.14,33.21
PE5  (via drill 0.3 pad 0.64)
  Top 0.203: U1.4 62.17,39.42 64.39,37.21 64.39,34.16 v64.52,34.04
  Bottom 0.203: J6.4 69.22,4.57 64.39,9.4 64.39,13.08 64.77,13.46 64.77,33.78 v64.52,34.04
PE6  (via drill 0.3 pad 0.64)
  Top 0.203: U1.5 62.17,38.92 63.88,37.21 63.88,34.67 v63.75,34.54
  Bottom 0.203: J6.5 64.78,9.52 64.78,12.96 65.15,13.34 65.15,34.29 64.77,34.67 63.88,34.67 v63.75,34.54
PFBOUT  (via drill 0.3 pad 0.64)
  Top 0.152: IC5.19 40.89,33.78
  Top 0.203: 39.69,34.61 39.62,34.67 | IC5.16 40.26,35.31 39.62,34.67 | 40.89,33.78 40,33.78 39.62,34.16 39.62,34.67 | IC5.30 48.53,32.66 C50.1 v47.97,33.44 48.57,34.04 C54.2
  Top 0.406: 39.62,34.67 v39.37,34.67 38.23,34.67 C53.2 35.88,33.78 C55.+
  Bottom 0.406: v39.37,34.67 39.37,34.16 39.88,33.66 47.75,33.66 v47.97,33.44
RD+
  Top 0.203: U3.14 R10.2 32,39.75 32.89,39.75 35.33,37.31 IC5.12
RD-
  Top 0.203: U3.16 R11.1 32,40.26 33.02,40.26 35.47,37.81 IC5.11
RESET  (via drill 0.3 pad 0.64)
  Top 0.203: U1.14 v59.96,34.42 59.44,34.42 R24.1 | IC2.8 39.94,15.05 38.67,16.32 v28.96,16.32 v27.3,16.32
  Bottom 0.203: v28.96,16.32 28.96,23.01 35.79,29.84 39.62,29.84 41.15,31.38 41.15,31.62 41.53,32 43.81,32 44.2,31.62 49.02,31.62 49.91,32.51 58.05,32.51 v59.96,34.42
  Bottom 0.305: v27.3,16.32 27.3,8.89 J11.3
RX+
  Top 0.203: U3.3 16.61,38.73 arc45 16.44,38.66 15.95,38.17 arc45 15.88,37.99 15.88,37.08 arc90 16.13,36.83 16.26,36.83 arc-90 16.51,36.58 16.51,36.45 arc-90 16.26,36.2 16.03,36.2 arc45 15.14,35.82 14.7,35.39 arc-45 14.48,35.3 J7.3
RX-
  Top 0.203: U3.1 15.98,41.27 arc45 15.8,41.2 15.31,40.71 arc45 15.24,40.53 15.24,38.84 arc-45 15.17,38.66 14.94,38.43 arc-45 14.76,38.36 J7.6
SDIO_CK  (via drill 0.3 pad 0.64)
  Top 0.203: U1.80 73.22,45.53 v70.87,47.88
  Bottom 0.203: v70.87,47.88 68.2,47.88 66.67,49.4 J13.5
SDIO_CMD  (via drill 0.3 pad 0.64)
  Top 0.203: U1.83 71.72,46.01 v69.22,48.51
  Bottom 0.203: v69.22,48.51 J13.6
SDIO_D0  (via drill 0.3 pad 0.64)
  Top 0.203: 77.01,35.88 U1.65 77.02,35.87 77.8,35.87 v78.11,35.56
  Bottom 0.203: v78.11,35.56 76.96,36.7 72.39,36.7 68.83,40.26 63.25,40.26 56.52,46.99 J13.1
SDIO_D1  (via drill 0.3 pad 0.64)
  Top 0.203: U1.66 78.51,36.42 v78.74,36.2
  Bottom 0.203: v78.74,36.2 77.85,37.08 72.52,37.08 68.96,40.64 63.5,40.64 59.05,45.09 J13.2
SDIO_D2
  Top 0.203: J13.3 62.86,52.07 67.31,52.07 67.94,51.44 67.94,50.16 68.58,49.53 70.61,49.53 74.22,45.93 U1.78
SDIO_D3
  Top 0.203: U1.79 73.72,45.9 70.46,49.15 65.79,49.15 J13.4
SPI2_MISO  (via drill 0.3 pad 0.64)
  Top 0.203: 60.42,32.86 v60.32,32.77 60.48,32.92 U1.17 62.71,32.92 63.5,32.13 63.5,28.7 60.32,25.53 60.32,24.45 56.77,20.89 56.77,17.4 v56.52,17.14 | v60.32,17.14 68.58,17.14 | 68.58,17.14 68.73,17.14 | J9.7 68.35,17.37 68.58,17.14
  Bottom 0.203: v56.52,17.14 v60.32,17.14 | J12.1 52.7,31.75 59.31,31.75 v60.32,32.77
SPI2_MOSI  (via drill 0.3 pad 0.64)
  Top 0.203: U1.18 62.57,32.42 63.12,31.88 63.12,28.83 59.69,25.4 v59.69,24.77 59.69,24.38 56.39,21.08 56.39,18.03 55.88,17.53 55.88,13.34 v56.52,12.7 | v60.32,12.7 60.83,13.21 68.72,13.21 68.49,12.97 J9.3 68.33,12.95 68.58,12.7 68.69,12.7
  Bottom 0.203: v56.52,12.7 v60.32,12.7 | v59.69,24.77 55.88,24.77 55.24,25.4 55.24,26.67 J12.5
SPI2_SCK  (via drill 0.3 pad 0.64)
  Top 0.203: U1.47 73.72,27.3 | U1.47 | U1.47 73.79,27.1 73.79,24.26 71.75,22.23 71.75,16.51 70.42,15.17 J9.5 68.77,15.17 68.83,15.24 | v63.05,15.24 68.83,15.24 | 68.83,15.24 68.89,15.24
  Bottom 0.203: v63.05,15.24 63.05,22.96 62.45,23.56 59.25,23.56 51.37,23.56 50.16,24.77 50.16,26.67 J12.2
SPI3_MISO  (via drill 0.3 pad 0.64)
  Top 0.203: U1.90 68.22,45.91 66.5,47.62 23.88,47.62 v23.24,46.99
  Bottom 0.203: v23.24,46.99 J1.6
SPI3_MOSI  (via drill 0.3 pad 0.64)
  Top 0.203: U1.91 67.72,45.85 66.32,47.24 26.04,47.24 v25.78,46.99
  Bottom 0.203: v25.78,46.99 J1.7
SPI3_NSS
  Top 0.203: U1.77 74.72,45.94 70.48,50.16 70.48,51.82 69.85,52.45 26.16,52.45 J1.8
SPI3_SCK
  Top 0.203: U1.89 68.72,46.01 66.72,48.01 22.35,48.01 | 22.35,48.01 19.69,48.01 J1.5 | D5.- 22.23,47.88 22.35,48.01
SWCLK  (via drill 0.3 pad 0.64)
  Top 0.203: U1.76 75.22,39.4 73.22,37.4 71.81,37.4 69.22,34.81 69.22,33.4 v69.47,33.15 | R45.2 40,8.51 v40,10.16 40,10.76 IC2.16 | v65.41,10.79 v59.69,10.79
  Bottom 0.203: v69.47,33.15 68.72,33.15 65.98,30.41 65.98,11.37 v65.41,10.79 | v59.69,10.79 40.64,10.79 v40,10.16
SWDIO  (via drill 0.3 pad 0.64)
  Top 0.203: U1.72 75.75,39.42 73.28,36.96 71.87,36.96 69.67,34.76 69.67,33.83 70.1,33.4 v70.1,32.64 | v66.04,10.16 v60.32,10.16
  Top 0.305: IC2.17 v40.79,9.53 40.79,8.99 R44.1
  Bottom 0.203: v66.04,10.16 66.36,10.48 66.36,30.21 68.66,32.51 69.98,32.51 v70.1,32.64 | v60.32,10.16 41.43,10.16 v40.79,9.53
TD+
  Top 0.203: U3.9 R8.2 32,33.4 33.15,33.4 35.56,35.81 IC5.15
TD-
  Top 0.203: U3.11 R9.1 32,33.91 33.02,33.91 35.42,36.31 IC5.14
TGT_3V3  (via drill 0.3 pad 0.64)
  Top 0.203: IC2.6 41.79,15.99 v41.66,16.13 41.53,16.26 39.75,16.26 C30.2
  Top 0.254: R43.2 16.13,6.73 13.97,6.73 | 13.97,6.73 11.56,6.73 R41.2 | R42.2 13.84,6.6 13.97,6.73
  Top 0.305: IC2.29 46.49,12.95 C29.2
  Top 0.406: R43.2 18.41,4.45 36.2,4.45 v36.32,4.32 | v45.59,6.86 46.99,8.26 C1.2 46.99,12.45 C29.2 R5.2 v49.53,14.1 | v42.16,6.86 R44.2 | R37.2 36.7,9.27 Q7.2 36.32,8.89 v36.32,8.26 | 45.85,22.73 R33.2 48.39,20.32 R39.2 v49.53,17.14
  Bottom 0.406: v36.32,4.32 36.32,6.48 | 36.32,6.48 36.32,6.86 | 36.32,6.86 36.32,7.24 | 36.32,7.24 v36.32,8.26 | v45.59,6.86 v42.16,6.86 36.7,6.86 | 36.7,6.86 36.32,6.86 | 36.32,7.24 36.7,6.86 | 36.7,6.86 36.32,6.48 | v49.53,14.1 v49.53,17.14 | v49.53,17.14 42.67,17.14 v41.66,16.13 | I_3V3.T v49.53,17.14
TGT_D+
  Top 0.203: D11.1 9.52,9.27 8.89,9.91 7.62,9.91 7.05,9.34 6.98,9.27 J8.3
  Top 0.305: D11.1 R13.2 15.62,8.38 R36.2
TGT_D-
  Top 0.203: D11.2 9.52,11.05 8.89,10.41 7.37,10.41 6.87,9.92 J8.2
  Top 0.305: R14.2 D11.2
TX+
  Top 0.203: U3.8 16.76,32.38 arc90 16.51,32.13 16.51,31.37 arc-90 16.26,31.11 16.13,31.11 arc-90 15.88,31.37 15.88,33.17 arc45 15.8,33.35 15.57,33.58 arc45 15.39,33.66 13.61,33.66 J7.1
TX-
  Top 0.203: J7.2 14.82,34.28 arc45 15.52,34.57 15.8,34.85 arc-45 15.98,34.92 16.26,34.92 arc-90 16.51,34.67 16.51,33.91 arc90 16.76,33.66 16.89,33.66 arc90 17.14,33.91 17.14,34.67 arc-90 17.4,34.92 U3.6
USART1_RX  (via drill 0.3 pad 0.64)
  Top 0.203: U1.93 66.72,45.64 65.88,46.48 37.59,46.48 36.83,45.72 34.29,45.72 v33.66,46.35
  Bottom 0.203: v33.66,46.35 J4.8
USART1_TX  (via drill 0.3 pad 0.64)
  Top 0.203: U1.92 67.22,45.74 66.1,46.86 36.7,46.86 v36.2,46.35
  Bottom 0.203: v36.2,46.35 J4.7
USART6_RX  (via drill 0.3 pad 0.64)
  Top 0.203: U1.64 75.95,35.42 v75.82,35.56 | v71.75,6.99 74.3,4.45 77.47,4.45 J6.8
  Bottom 0.203: v75.82,35.56 76.2,35.18 76.2,33.02 75.06,31.88 72.52,31.88 71.5,30.86 69.47,30.86 67.94,29.34 67.94,10.79 v71.75,6.99 | J6.8 79.38,4.32 P10.1 79.38,5.33
USART6_TX  (via drill 0.3 pad 0.64)
  Top 0.203: U1.63 75.69,34.92 v75.56,34.8 | v71.12,6.35 71.75,6.35 74.3,3.81 75.56,3.81 J6.7
  Bottom 0.203: v75.56,34.8 75.58,34.79 75.58,33.03 75.56,33.03 75.56,33.02 74.8,32.26 72.26,32.26 71.25,31.24 69.22,31.24 67.56,29.59 67.56,9.91 v71.12,6.35 | J6.7 76.83,4.32 P9.2 76.83,5.33
USB5V  (via drill 0.3 pad 0.64)
  Top 0.813: U2.3 C14.+ 18.86,21.59 | R12.2 R18.2 20.19,13.97 18.41,15.75 | 18.86,21.59 v18.41,21.59 | 18.41,15.75 18.41,16.26 | 18.41,16.26 18.41,21.08 | 18.41,21.08 v18.41,21.59 | v18.41,21.59 18.41,22.04 | 18.41,22.04 F1.2 | F3.2 17.91,15.75 | 17.91,15.75 18.41,15.75 | 17.91,15.75 18.41,16.26 | 18.41,22.04 18.86,21.59 | 18.86,21.59 18.86,21.53 18.41,21.08
  Bottom 0.406: 5V.T v18.41,21.59
VCAP1
  Top 0.203: U1.49 74.72,25.06 C23.2
VCAP2
  Top 0.305: U1.73 78.66,39.92 79.38,40.64 79.38,45.59 C24.2
VDDA
  Top 0.203: R25.2 60.07,30.35 61.39,30.35 U1.22
  Top 0.305: R25.2 C33.2 C21.2 L2.1
XTALIN
  Top 0.203: U1.12 60.46,35.42 59.69,36.2 59.69,37.85 59.51,38.03 X4.1 56.58,38.03 C27.2
XTALOUT
  Top 0.203: U1.13 60.32,34.92 59.62,35.63 X4.3 56.97,35.63 56.52,35.18 C28.2

## Text on the board
tPlace: 5V | SCL | SDA | B3 | B4 | B5 | B7 | B6 | A8 | D6 | D3 | C8 | C9 | D2 | B9 | B8 | GND | A15 | B14 | B15 | D13 | D12 | D11 | C10 | C11 | C12 | D12 | D11 | AREF | D6 | E0 | D3 | E1 | D7 | GND | D4 | D5 | D14 | D15 | D0 | D1 | E7 | E8 | E9 | E10 | E11 | E12 | E13 | E14 | E15 | D8 | D9 | D10 | B8 | B9 | BT0 | BT1 | 3V3 | 3V3 | GND | GND | NC | IOREF | RST | 3V3 | 5V | GND | NC | A0 | A3 | A4 | A5 | A6 | B0 | B1 | C0 | A9 | A10 | E4 | E5 | E6 | C13 | C6 | C7
bPlace: 5V | SCL | SDA | ALE | AREF | GND | PD3 | PD6 | PA8 | CLE | PB14 | PB15 | PD11 | PD12 | PD13 | NWAIT | L0 | SPI3_SCK | SPI3_MISO | SPI3_MOSI | SPI3_NSS | CLK | L1 | TX4 /SDIO_D2 | RX4 /SDIO_D3 | TX5 /SDIO_CK | DCMI_D5 /TX1 | RX5 /SDIO_CMD | SDIO_D5 /SCL1 | SDIO_D4 /SDA1 | NE1 | GND | DCMI_VSYNC /RX1 | DCMI_D3 /SDIO_D0 | DCMI_D2 /SDIO_D1 | NOE | NWE | 0 | 1 | 2 | 3 | SPI2 | MISO | 3V3/NC | 4 | 5 | 6 | SCK | MOSI | 7 | Arch Max | PE3 | GND | 8 | 9 | v1.03 09/04/2014 | FSMC | 10 | 11 | by Seeed Studio | 12 | 13 | www.seeedstudio.com | 14 | 15 | SCL1 | SDA1 | BOOT0 | BOOT1 | 3V3 | DB_TX | DB_RX | ANALOG IN | GND | IOREF | RST | 3V3 | 5V | GND | GND | NC | PA0/WKUP | PA3 | PA4 | PA5 | PA6 | PB0 | PB1 | PC0 | PA9 /DCMI_D0 | PA10/DCMI_D1 | PE4 /DCMI_D4 | PE5 /DCMI_D6 | PE6 /DCMI_D7 | PC13 | PC6 | PC7
tValues: Micro USB